# Altium schematic sheet Models.SchDoc
size A4
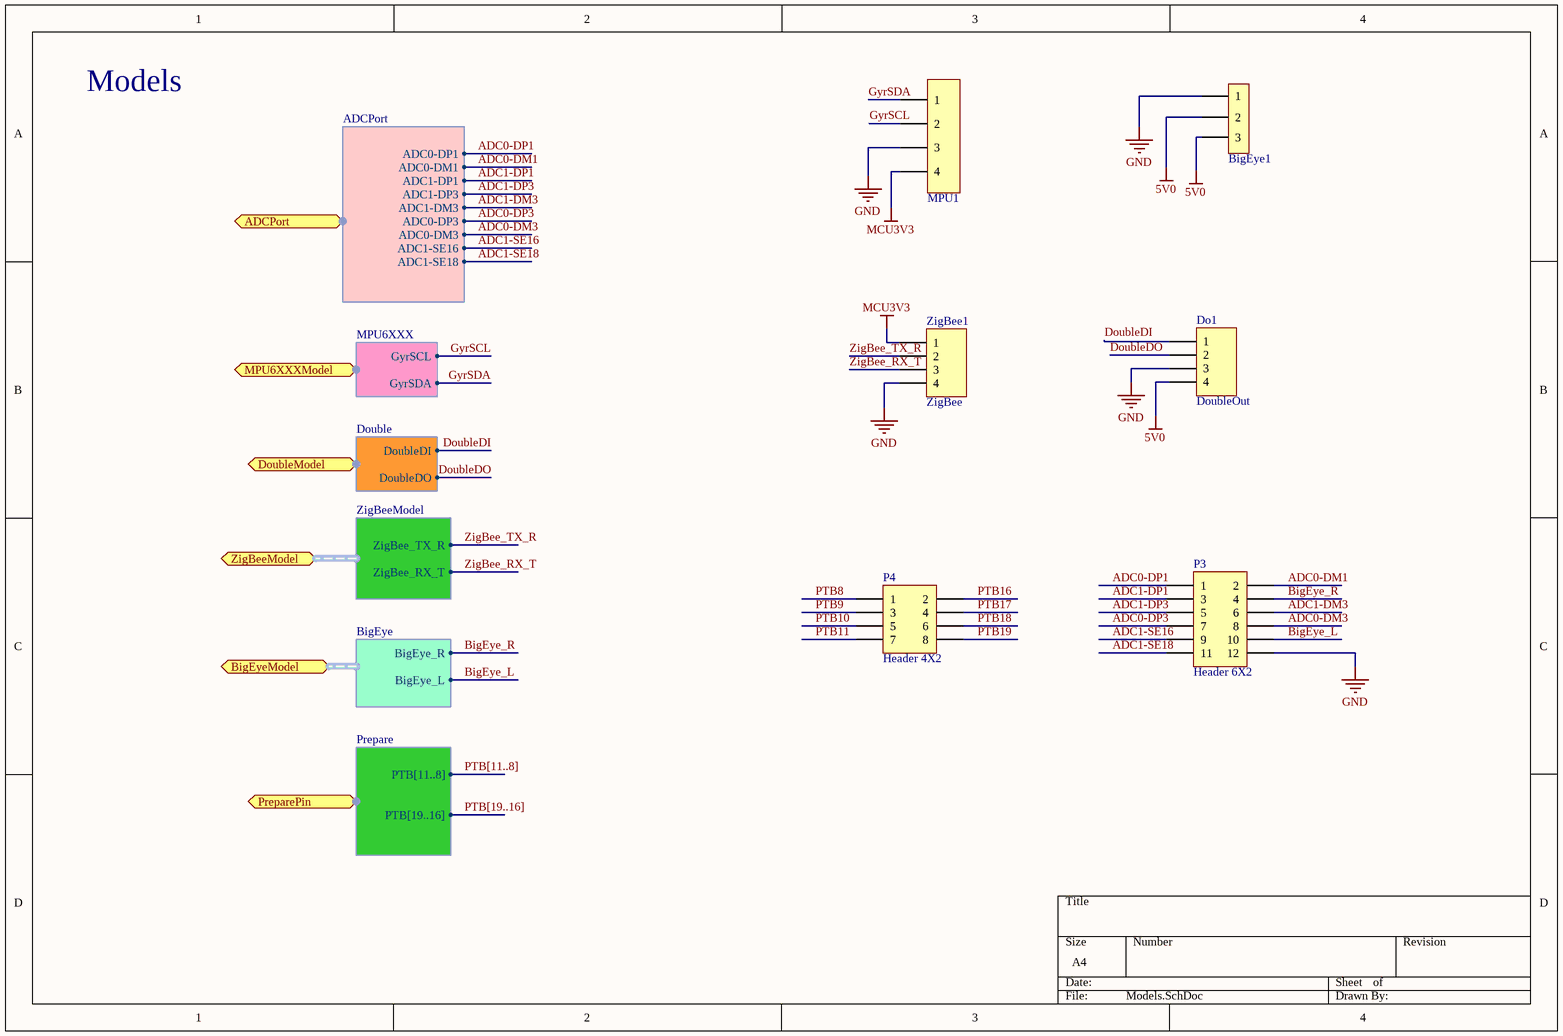
[diagram p0: Models.SchDoc]

## Parts
BigEye1  Header3  [Header3]  (value not drawn)
Do1  DoubleOut  [HDR1X4]
MPU1  Header4  [Header4]  (value not drawn)
P3  Header 6X2  [HDR2X6]
P4  Header 4X2  [HDR2X4]
ZigBee1  ZigBee  [HDR1X4]

## Ports
ADCPort (harness ADCPort), BigEyeModel (harness BigEye), DoubleModel (harness Double), MPU6XXXModel (harness MPU6XXX), PreparePin (harness Prepare), ZigBeeModel (harness ZigBeeModel)

## Harnesses
MPU6XXX: GyrSCL, GyrSDA
ZigBeeModel: ZigBee_TX_R, ZigBee_RX_T
BigEye: BigEye_R, BigEye_L
Double: DoubleDI, DoubleDO
ADCPort: ADC0-DP1, ADC0-DM1, ADC1-DP1, ADC1-DP3, ADC1-DM3, ADC0-DP3, ADC0-DM3, ADC1-SE16, ADC1-SE18
Prepare: PTB[11..8], PTB[19..16]

## Nets
5V0: BigEye1.2 BigEye1.3 Do1.4
GND: BigEye1.1 Do1.3 MPU1.3 P3.12 ZigBee1.4
MCU3V3: MPU1.4 ZigBee1.1
ADC0-DM1: P3.2 ; port ADCPort.ADC0-DM1
ADC0-DM3: P3.8 ; port ADCPort.ADC0-DM3
ADC0-DP1: P3.1 ; port ADCPort.ADC0-DP1
ADC0-DP3: P3.7 ; port ADCPort.ADC0-DP3
ADC1-DM3: P3.6 ; port ADCPort.ADC1-DM3
ADC1-DP1: P3.3 ; port ADCPort.ADC1-DP1
ADC1-DP3: P3.5 ; port ADCPort.ADC1-DP3
ADC1-SE16: P3.9 ; port ADCPort.ADC1-SE16
ADC1-SE18: P3.11 ; port ADCPort.ADC1-SE18
BigEye_L: P3.10 ; port BigEyeModel.BigEye_L
BigEye_R: P3.4 ; port BigEyeModel.BigEye_R
DoubleDI: Do1.1 ; port DoubleModel.DoubleDI
DoubleDO: Do1.2 ; port DoubleModel.DoubleDO
GyrSCL: MPU1.2 ; port MPU6XXXModel.GyrSCL
GyrSDA: MPU1.1 ; port MPU6XXXModel.GyrSDA
PTB8: P4.1
PTB9: P4.3
PTB10: P4.5
PTB11: P4.7
PTB16: P4.2
PTB17: P4.4
PTB18: P4.6
PTB19: P4.8
ZigBee_RX_T: ZigBee1.3 ; port ZigBeeModel.ZigBee_RX_T
ZigBee_TX_R: ZigBee1.2 ; port ZigBeeModel.ZigBee_TX_R

## Buses and harness runs
bus PTB[11..8]
bus PTB[19..16]

## Notes on the sheet
- Models

## Library data of the parts
Do1 ZigBee1 = Header 4: Header, 4-Pin; LatestRevisionDate: 17-Jul-2002; LatestRevisionNote: Re-released for DXP Platform.; Publisher: Altium Limited
P3 = Header 6X2: Header, 6-Pin, Dual row; LatestRevisionDate: 17-Jul-2002; LatestRevisionNote: Re-released for DXP Platform.; Publisher: Altium Limited
P4 = Header 4X2: Header, 4-Pin, Dual row; LatestRevisionDate: 17-Jul-2002; LatestRevisionNote: Re-released for DXP Platform.; Publisher: Altium Limited